# Altium schematic sheet conn.SchDoc
size A4; SheetNumber: 4; SheetTotal: 5
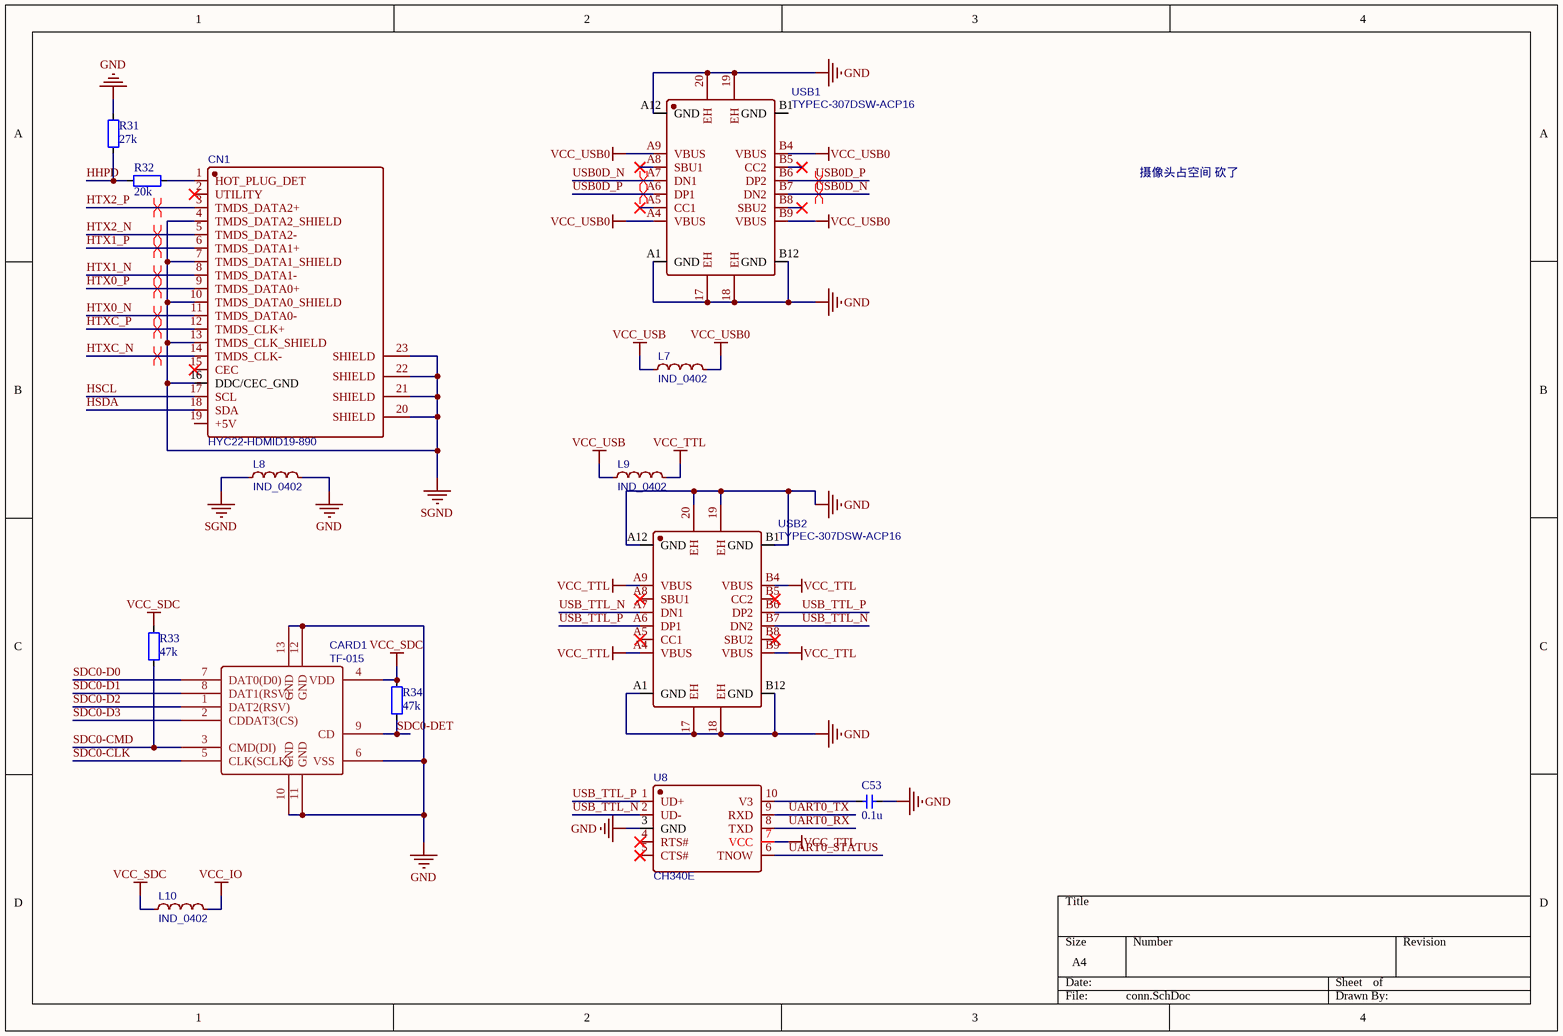
[diagram p0: conn.SchDoc]

## Parts
C53  value 0.1u  [C0402]  (hidden comment: CAP-0402)
CARD1  TF-015  [TF-SMD_TF-015]
CN1  HYC22-HDMID19-890  [HDMI-SMD_HYC22-HDMID19-890]
L7  IND_0402  [L0402]
L8  IND_0402  [L0402]
L9  IND_0402  [L0402]
L10  IND_0402  [L0402]
R31  value 27k  [R0402]  (hidden comment: RES-0402)
R32  value 20k  [R0402]  (hidden comment: RES-0402)
R33  value 47k  [R0402]  (hidden comment: RES-0402)
R34  value 47k  [R0402]  (hidden comment: RES-0402)
U8  CH340E  [MSOP-10_L3.0-W3.0-P0.50-LS5.0-BL]
USB1  TYPEC-307DSW-ACP16  [USB-C-SMD_TYPEC-307DSW-ACP16]
USB2  TYPEC-307DSW-ACP16  [USB-C-SMD_TYPEC-307DSW-ACP16]

## Nets
GND: C53.1 CARD1.6(VSS) CARD1.10(GND) CARD1.11(GND) CARD1.12(GND) CARD1.13(GND) L8.2 R31.1 U8.3(GND) USB1.17(EH) USB1.18(EH) USB1.19(EH) USB1.20(EH) USB1.A1(GND) USB1.A12(GND) USB1.B12(GND) USB2.17(EH) USB2.18(EH) USB2.19(EH) USB2.20(EH) USB2.A1(GND) USB2.A12(GND) USB2.B1(GND) USB2.B12(GND)
SGND: CN1.4(TMDS_DATA2_SHIELD) CN1.7(TMDS_DATA1_SHIELD) CN1.10(TMDS_DATA0_SHIELD) CN1.13(TMDS_CLK_SHIELD) CN1.16(DDC/CEC_GND) CN1.20(SHIELD) CN1.21(SHIELD) CN1.22(SHIELD) CN1.23(SHIELD) L8.1
VCC_IO: L10.2
VCC_SDC: CARD1.4(VDD) L10.1 R33.1 R34.1
VCC_TTL: L9.2 U8.7(VCC) USB2.A4(VBUS) USB2.A9(VBUS) USB2.B4(VBUS) USB2.B9(VBUS)
VCC_USB: L7.1 L9.1
VCC_USB0: L7.2 USB1.A4(VBUS) USB1.A9(VBUS) USB1.B4(VBUS) USB1.B9(VBUS)
HHPD: R31.2 R32.2
HSCL: CN1.17(SCL)
HSDA: CN1.18(SDA)
HTX0_N: CN1.11(TMDS_DATA0-)
HTX0_P: CN1.9(TMDS_DATA0+)
HTX1_N: CN1.8(TMDS_DATA1-)
HTX1_P: CN1.6(TMDS_DATA1+)
HTX2_N: CN1.5(TMDS_DATA2-)
HTX2_P: CN1.3(TMDS_DATA2+)
HTXC_N: CN1.14(TMDS_CLK-)
HTXC_P: CN1.12(TMDS_CLK+)
SDC0-CLK: CARD1.5(CLK(SCLK))
SDC0-CMD: CARD1.3(CMD(DI)) R33.2
SDC0-D0: CARD1.7(DAT0(D0))
SDC0-D1: CARD1.8(DAT1(RSV))
SDC0-D2: CARD1.1(DAT2(RSV))
SDC0-D3: CARD1.2(CDDAT3(CS))
SDC0-DET: CARD1.9(CD) R34.2
UART0_RX: U8.8(TXD)
UART0_STATUS: U8.6(TNOW)
UART0_TX: U8.9(RXD)
USB0D_N: USB1.A7(DN1) USB1.B7(DN2)
USB0D_P: USB1.A6(DP1) USB1.B6(DP2)
USB_TTL_N: U8.2(UD-) USB2.A7(DN1) USB2.B7(DN2)
USB_TTL_P: U8.1(UD+) USB2.A6(DP1) USB2.B6(DP2)
NetC53_2: C53.2 U8.10(V3)
NetCN1_1: CN1.1(HOT_PLUG_DET) R32.1

Not connected (* = marked no-connect by the designer): CN1 2(UTILITY)* 15(CEC)* 19(+5V); U8 4(RTS#)* 5(CTS#)*; USB1 A5(CC1)* A8(SBU1)* B1(GND) B5(CC2)* B8(SBU2)*; USB2 A5(CC1)* A8(SBU1)* B5(CC2)* B8(SBU2)*

## Layout directives
differential pair: HTX0_N, HTX0_P, HTX1_N, HTX1_P, HTX2_N, HTX2_P, HTXC_N, HTXC_P, USB0D_N, USB0D_P

## Notes on the sheet
- 摄像头占空间 砍了

## Library data of the parts
C53 = CAP-0402: Capacitor
CARD1 = TF-015: BOM_Manufacturer: SOFNG; BOM_Supplier: LCSC; BOM_Manufacturer Part: TF-015; BOM_Supplier Part: C113206; spicePre: C; spiceSymbolName: TF-015
CN1 = HYC22-HDMID19-890: BOM_Manufacturer: HOAUC; Contributor: LCSC; BOM_Supplier: LCSC; BOM_Supplier Part: C711356; BOM_Manufacturer Part: HYC22-HDMID19-890; BOM_JLCPCB Part Class: Extended Part; spicePre: C; spiceSymbolName: HYC22-HDMID19-890
L7-L10 = IND_0402: nameAlias: Value(H); Contributor: LCEDA_Lib; spicePre: L; spiceSymbolName: L0402_US
R31-R34 = RES-0402: Resistor
U8 = CH340E: BOM_Manufacturer: WCH; BOM_Supplier: LCSC; BOM_Manufacturer Part: CH340E; BOM_Supplier Part: C99652; BOM_JLCPCB Part Class: Extended Part; spicePre: U; spiceSymbolName: CH340E
USB1 USB2 = TYPEC-307DSW-ACP16: BOM_Manufacturer: XUNPU(讯普); Contributor: LCSC; BOM_Supplier: LCSC; BOM_Supplier Part: C2840402; BOM_Manufacturer Part: TYPEC-307DSW-ACP16; spicePre: U; spiceSymbolName: TYPEC-307DSW-ACP16